# Altium schematic sheet QCopterFC_POWER_Sch.SchDoc
size A4
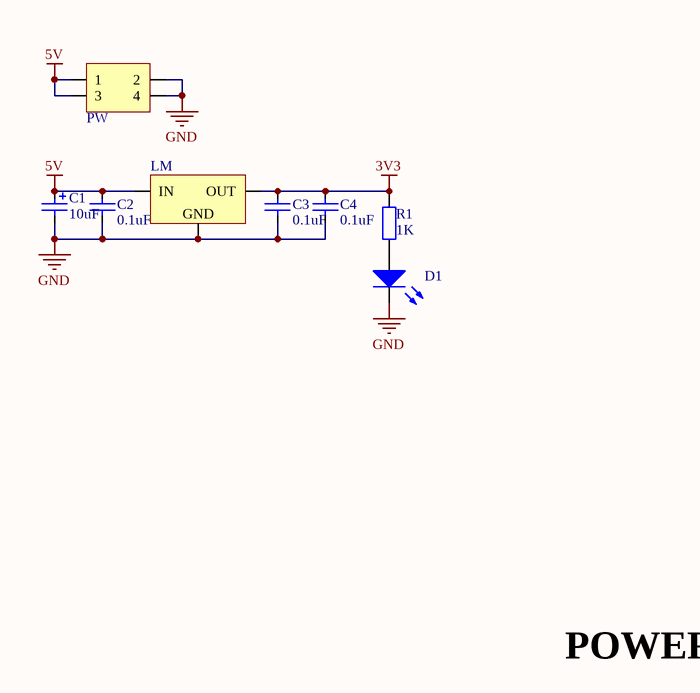
[diagram p0: QCopterFC_POWER_Sch.SchDoc]

## Parts
C1  value 10uF  [CAP_TAN_B1210]  (hidden comment: Cap_Tan_1210)
C2  value 0.1uF  [CAP_0603]  (hidden comment: Cap_0603)
C3  value 0.1uF  [CAP_0603]  (hidden comment: Cap_0603)
C4  value 0.1uF  [CAP_0603]  (hidden comment: Cap_0603)
D1  LED_0603_BLUE  [LED_0603_WHITE]  (value not drawn)
LM  LM1117  [SOT223]  (value not drawn)
PW  HDR2X2_90_2.54  [HDR2X2_90_2.54]  (value not drawn)
R1  value 1K  [RES_0603]  (hidden comment: Res_0603)

## Nets
3V3: C3.2 C4.2 LM.2(OUT) R1.2
5V: C1.1 C2.2 LM.3(IN) PW.1 PW.3
GND: C1.2 C2.1 C3.1 C4.1 D1.2(K) LM.1(GND) PW.2 PW.4
NetD1_1: D1.1(A) R1.1

## Notes on the sheet
- POWER

## Library data of the parts
C1 = Cap_Tan_1210: Capacitor
C2-C4 = Cap_0603: Capacitor
D1 = LED_0603_BLUE: LED
LM = LM1117: Power
PW = HDR2X2_90_2.54: Header
R1 = Res_0603: Resistor